# Altium project ATmega328 Circuit_Project.PrjPcb
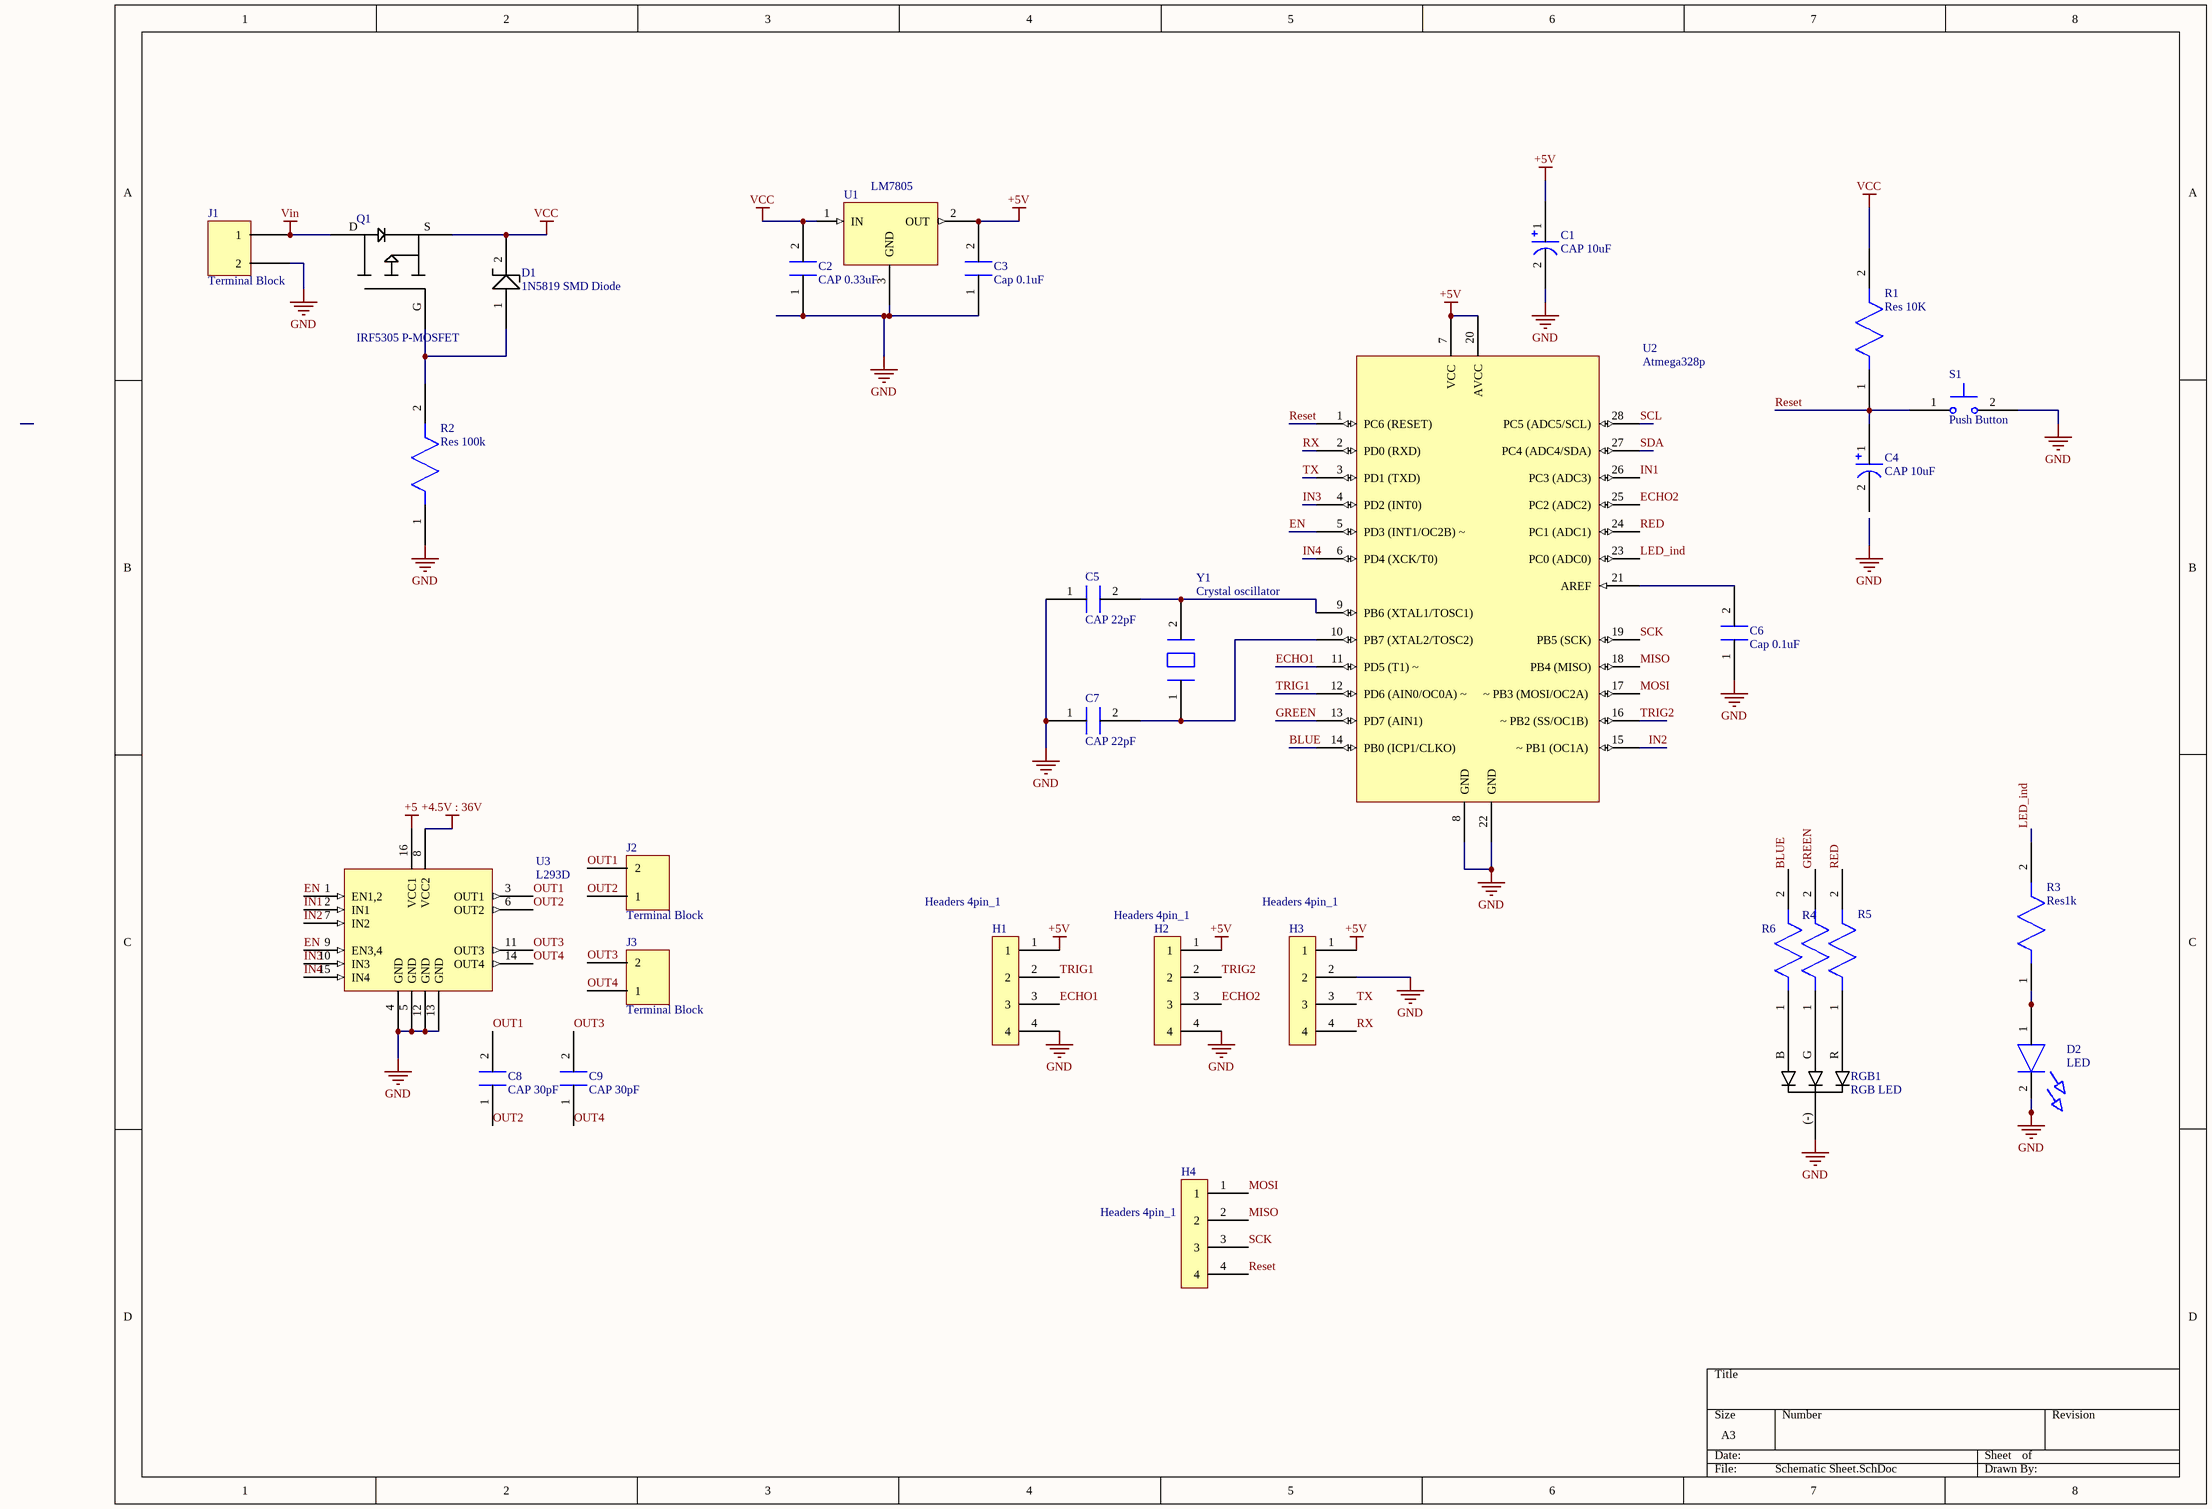
[diagram p0: Schematic Sheet.SchDoc]
1 sheet, 31 parts. Net scope: global (net labels, ports and power ports of the same name join across sheets).
Board file: PCB1.PcbDoc

## Sheet Schematic Sheet.SchDoc
size A3; SheetNumber: 1; SheetTotal: 1

### Parts
C1  CAP 10uF  [Cap 10uF]
C2  CAP 0.33uF
C3  Cap 0.1uF
C4  CAP 10uF  [Cap 10uF]
C5  CAP 22pF  [Cap 22pF]
C6  Cap 0.1uF
C7  CAP 22pF  [Cap 22pF]
C8  CAP 30pF
C9  CAP 30pF
D1  1N5819 SMD Diode  [1N5819 SMD Diode]
D2  LED  [LED]
H1  Headers 4pin_1  [Header 4pin]
H2  Headers 4pin_1  [Header 4pin]
H3  Headers 4pin_1  [Header 4pin]
H4  Headers 4pin_1  [Header 4pin]
J1  Terminal Block  [Terminal Block 2pin]
J2  Terminal Block  [Terminal Block 2pin]
J3  Terminal Block  [Terminal Block 2pin]
Q1  IRF5305 P-MOSFET  [IRF5305]
R1  Res 10K  [Res10K]
R2  Res 100k  [Res100K]
R3  Res1k  [Res 1K]
R4  Resistor  (value not drawn)
R5  Resistor  (value not drawn)
R6  Resistor  (value not drawn)
RGB1  RGB LED  [RGB LED]
S1  Push Button  [Push Button]
U1  LM7805  [LM7805]
U2  Atmega328p  [ATMega 328 P-PU - duplicate]
U3  L293D  [L293D]
Y1  Crystal oscillator  [Crrystal 16MHZ]

### Nets
+4.5V : 36V: U3.8(VCC2)
+5: U3.16(VCC1)
+5V: C1.1 C3.2 H1.1 H2.1 H3.1 U1.2(OUT) U2.7(VCC) U2.20(AVCC)
GND: C1.2 C2.1 C3.1 C5.1 C6.1 C7.1 D2.2 H1.4 H2.4 H3.2 J1.2 R2.1 RGB1.(-) S1.2 U1.3(GND) U2.8(GND) U2.22(GND) U3.4(GND) U3.5(GND) U3.12(GND) U3.13(GND)
VCC: C2.2 D1.2 Q1.S R1.2 U1.1(IN)
Vin: J1.1 Q1.D
BLUE: R6.2 U2.14(PB0_(ICP1/CLKO))
ECHO1: H1.3 U2.11(PD5_(T1)_~)
ECHO2: H2.3 U2.25(PC2_(ADC2))
EN: U2.5(PD3_(INT1/OC2B)_~) U3.1(EN1,2) U3.9(EN3,4)
GREEN: R4.2 U2.13(PD7_(AIN1))
IN1: U2.26(PC3_(ADC3)) U3.2(IN1)
IN2: U2.15(~_PB1_(OC1A)) U3.7(IN2)
IN3: U2.4(PD2_(INT0)) U3.10(IN3)
IN4: U2.6(PD4_(XCK/T0)) U3.15(IN4)
LED_ind: R3.2 U2.23(PC0_(ADC0))
MISO: H4.2 U2.18(PB4_(MISO))
MOSI: H4.1 U2.17(~_PB3_(MOSI/OC2A))
OUT1: C8.2 J2.2 U3.3(OUT1)
OUT2: C8.1 J2.1 U3.6(OUT2)
OUT3: C9.2 J3.2 U3.11(OUT3)
OUT4: C9.1 J3.1 U3.14(OUT4)
RED: R5.2 U2.24(PC1_(ADC1))
Reset: C4.1 H4.4 R1.1 S1.1 U2.1(PC6_(RESET))
RX: H3.4 U2.2(PD0_(RXD))
SCK: H4.3 U2.19(PB5_(SCK))
SCL: U2.28(PC5_(ADC5/SCL))
SDA: U2.27(PC4_(ADC4/SDA))
TRIG1: H1.2 U2.12(PD6_(AIN0/OC0A)_~)
TRIG2: H2.2 U2.16(~_PB2_(SS/OC1B))
TX: H3.3 U2.3(PD1_(TXD))
NetC5_2: C5.2 U2.9(PB6_(XTAL1/TOSC1)) Y1.2
NetC6_2: C6.2 U2.21(AREF)
NetC7_2: C7.2 U2.10(PB7_(XTAL2/TOSC2)) Y1.1
NetD1_1: D1.1 Q1.G R2.2
NetD2_1: D2.1 R3.1
NetR4_1: R4.1 RGB1.G
NetR5_1: R5.1 RGB1.R
NetR6_1: R6.1 RGB1.B

Not connected (* = marked no-connect by the designer): C4 2